# Altium schematic sheet demo_dermis_main_testboard_ncd2400.SchDoc
size E
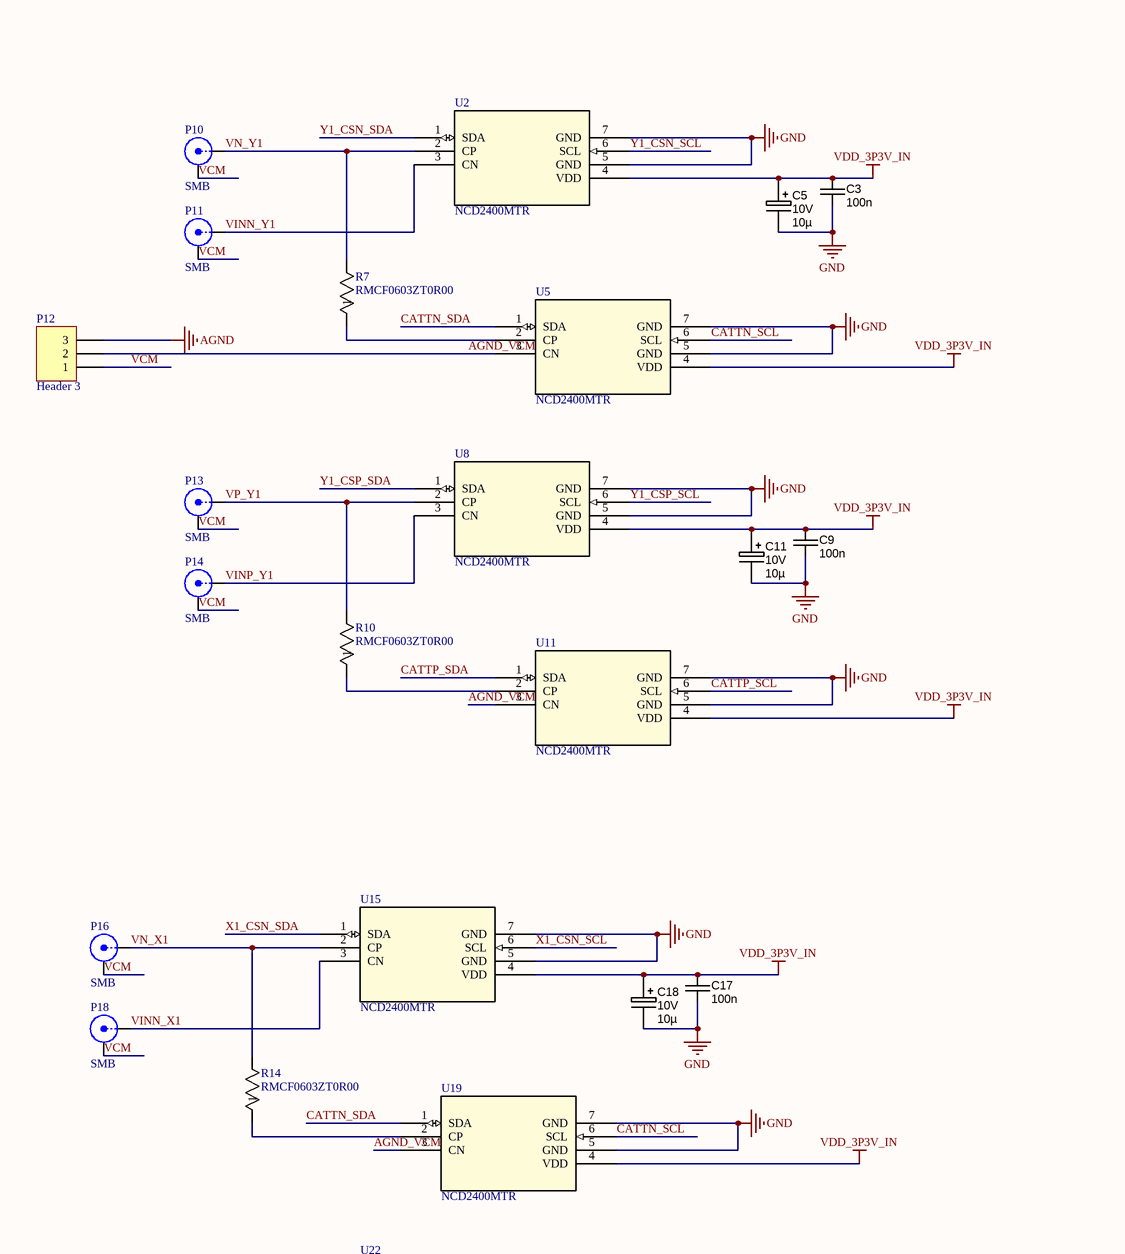
[diagram p0: demo_dermis_main_testboard_ncd2400.SchDoc, top left]
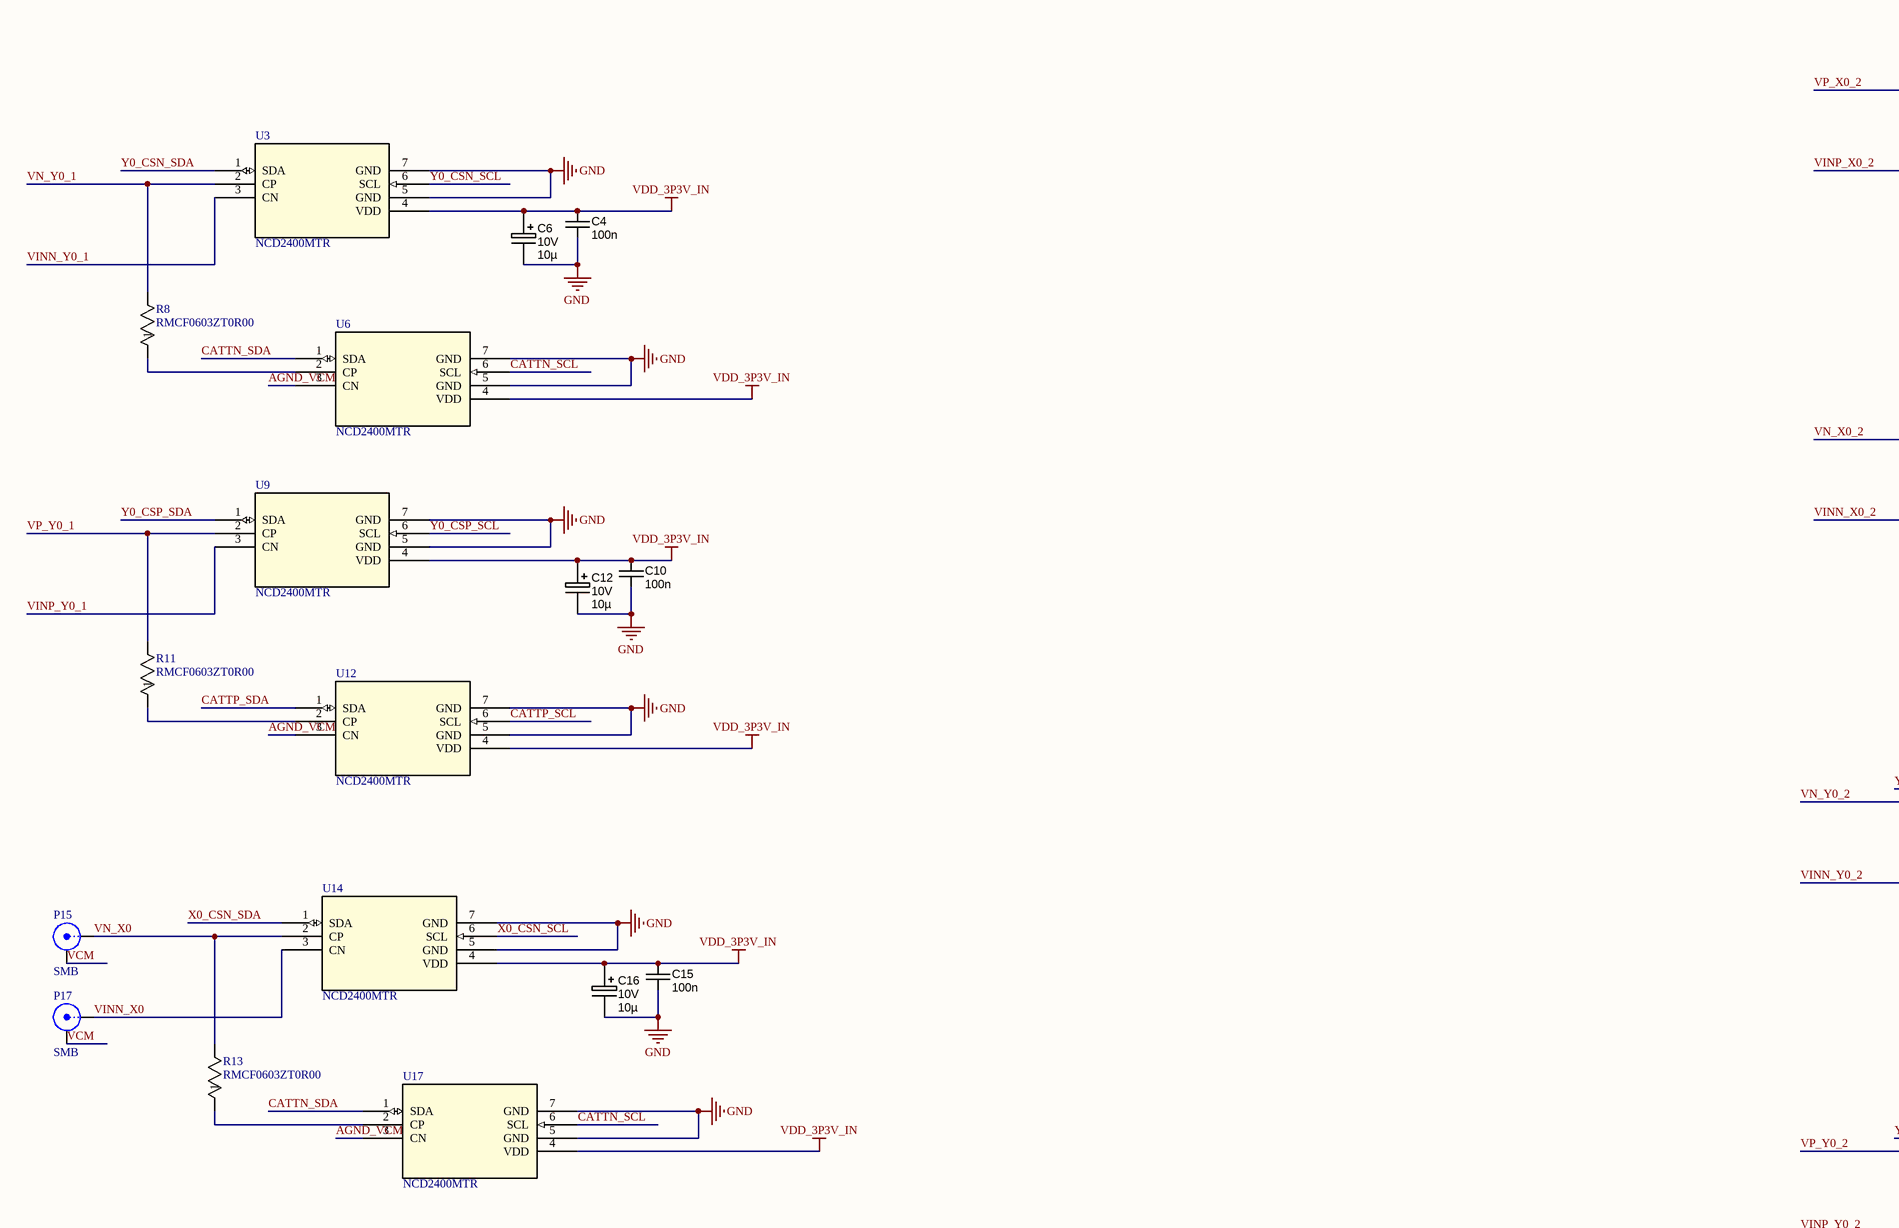
[diagram p1: demo_dermis_main_testboard_ncd2400.SchDoc, top middle]
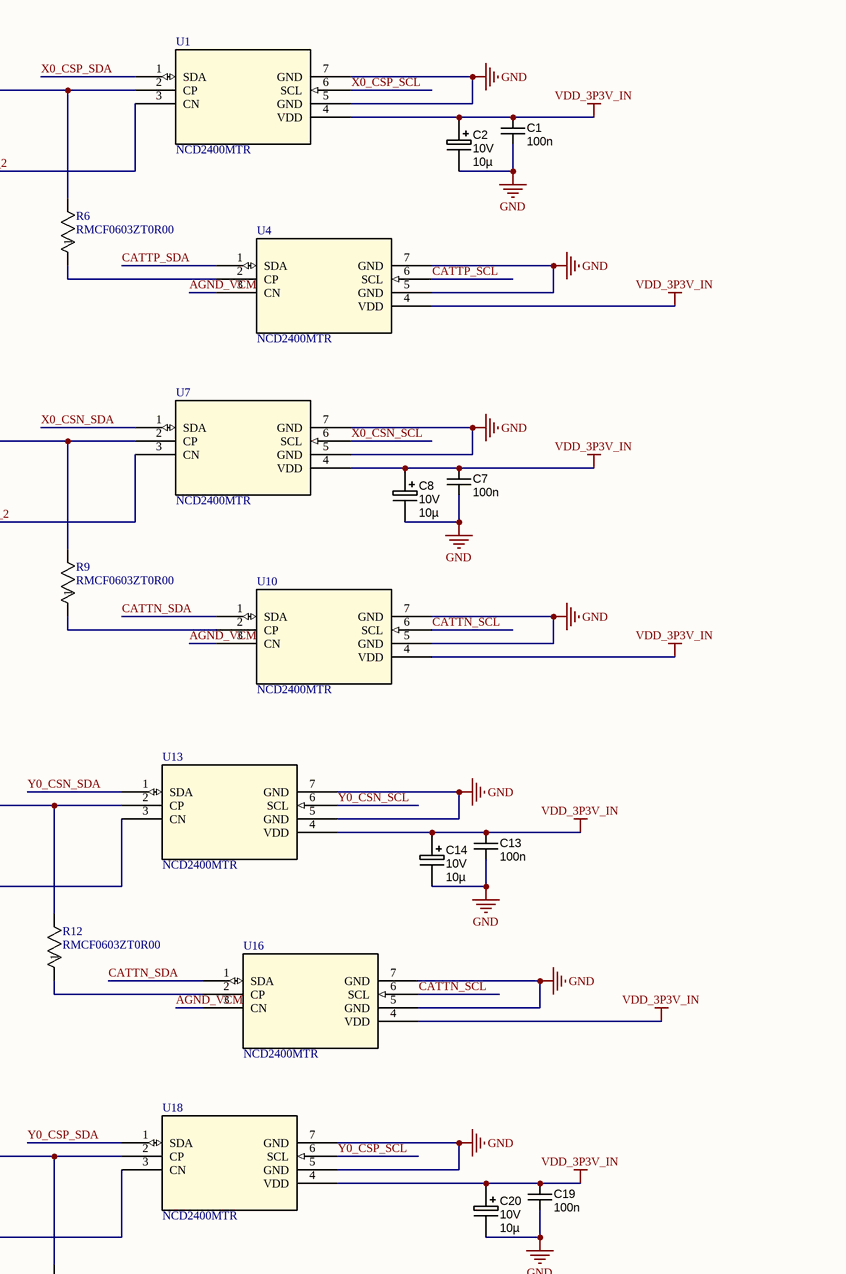
[diagram p2: demo_dermis_main_testboard_ncd2400.SchDoc, top right]
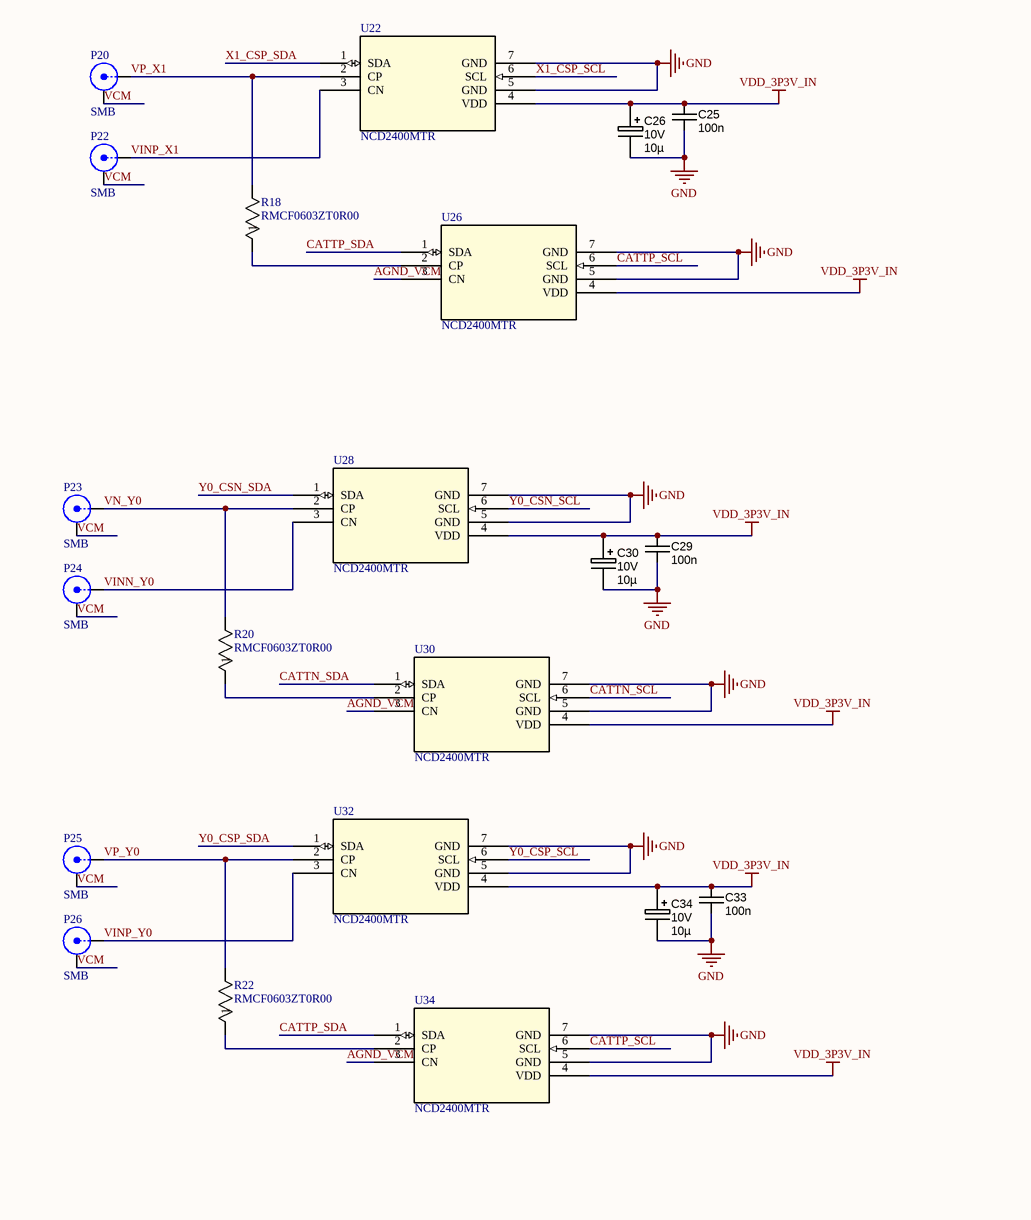
[diagram p3: demo_dermis_main_testboard_ncd2400.SchDoc, bottom left]
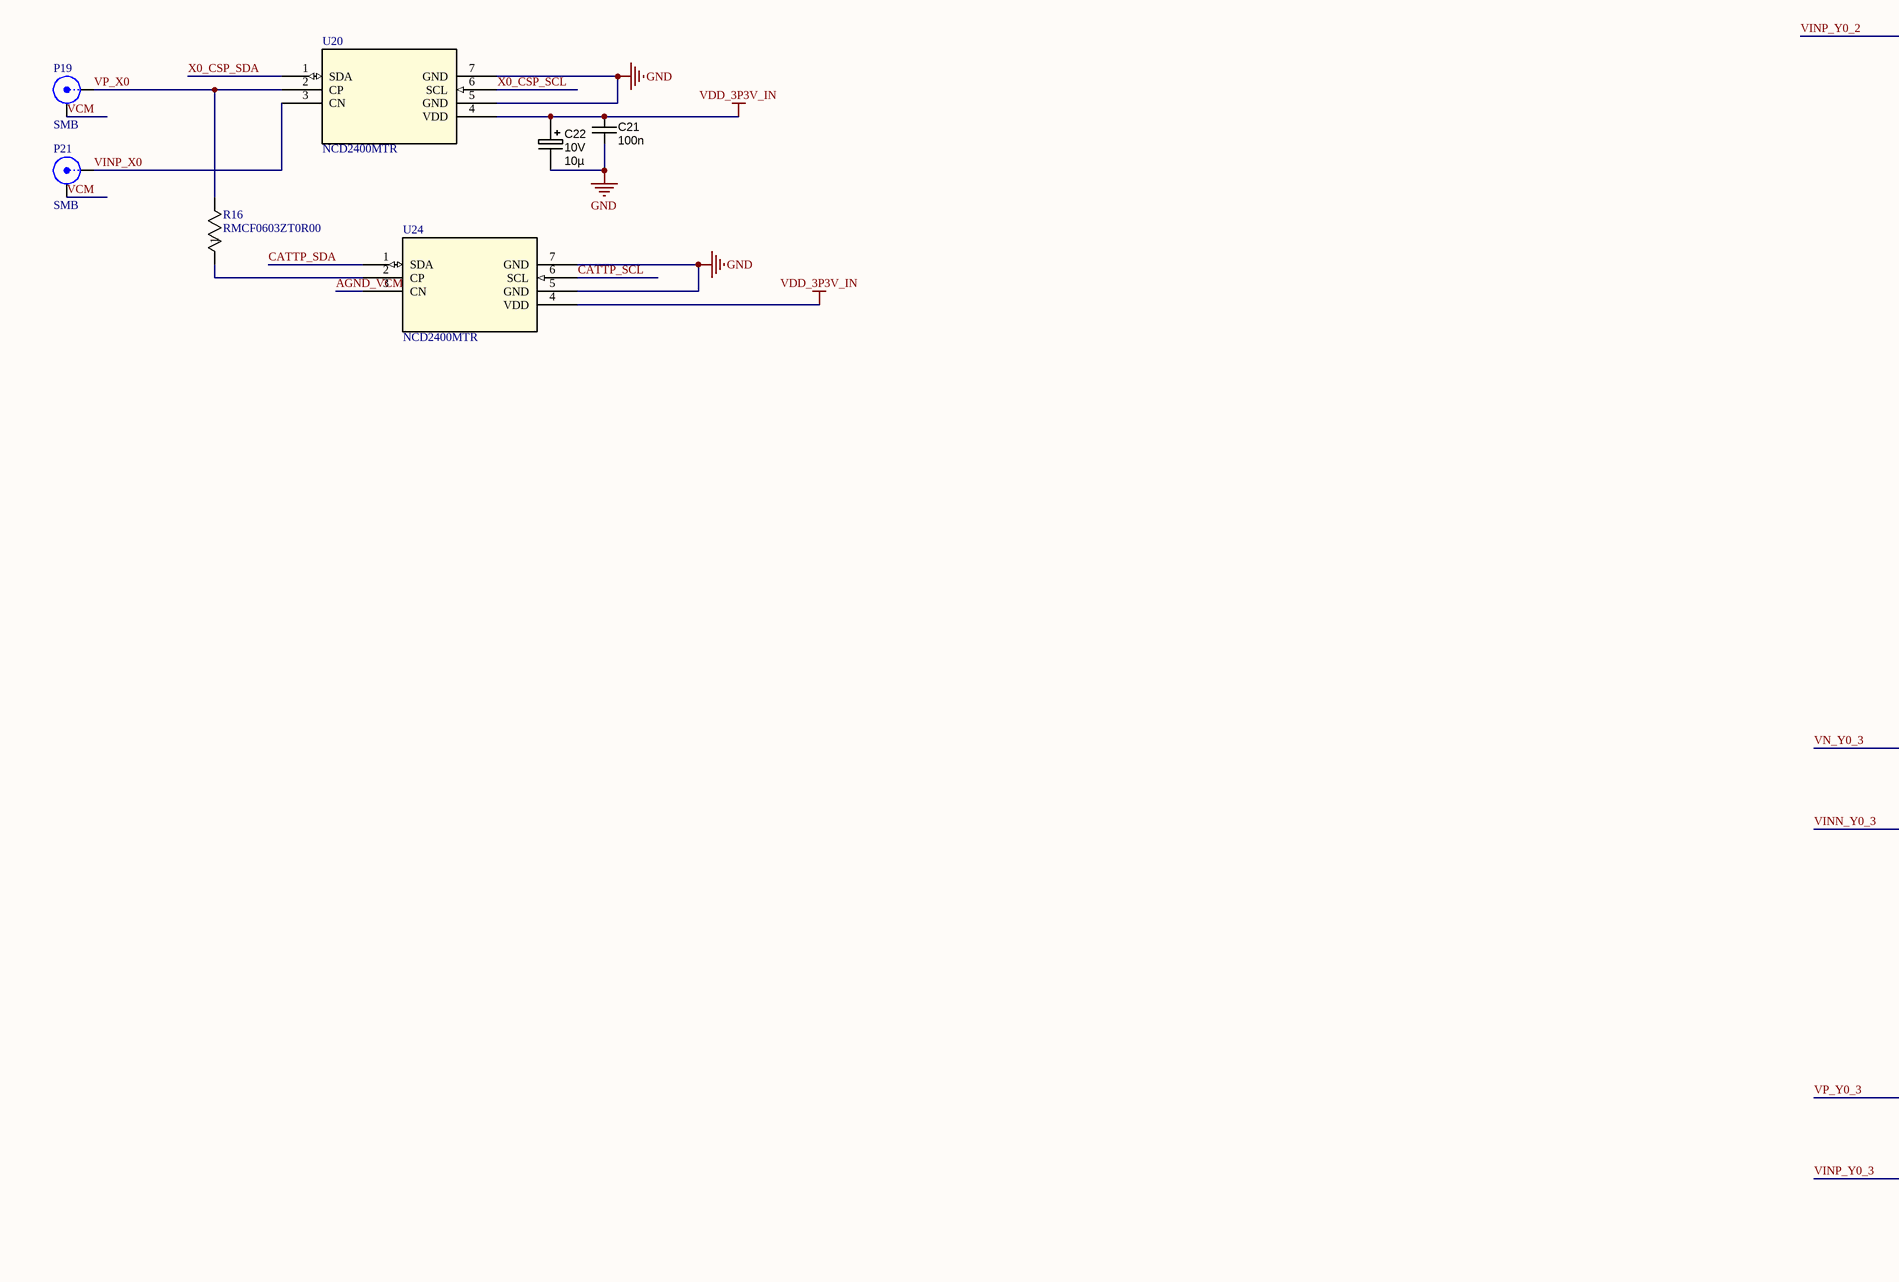
[diagram p4: demo_dermis_main_testboard_ncd2400.SchDoc, bottom middle]
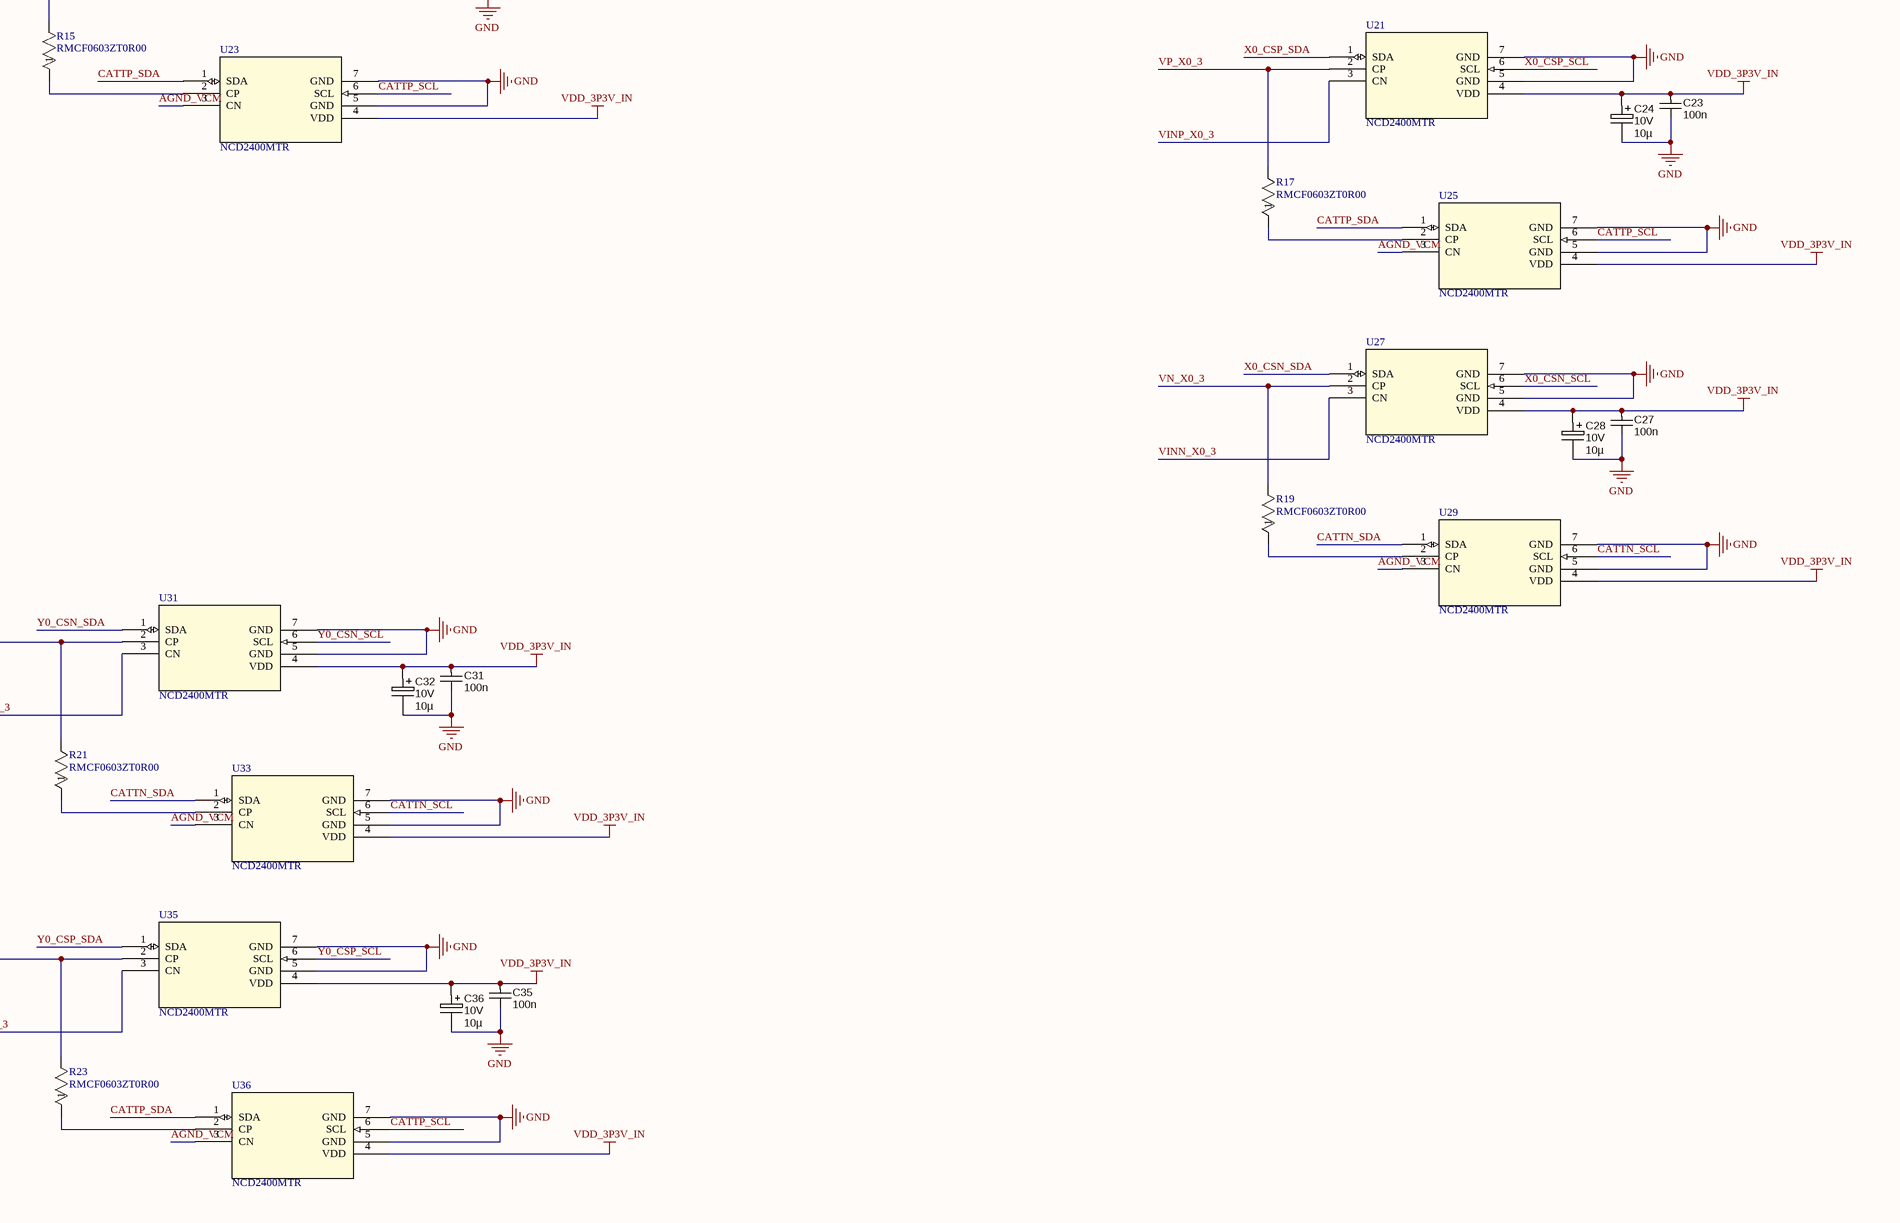
[diagram p5: demo_dermis_main_testboard_ncd2400.SchDoc, bottom right]

## Parts
C1  value 100n  [CAPC1608N]  (hidden comment: approved sub OK)
C2  Ratings: 10V  [CAPMP2012X150USR]  (hidden comment: 10µ)
C3  value 100n  [CAPC1608N]  (hidden comment: approved sub OK)
C4  value 100n  [CAPC1608N]  (hidden comment: approved sub OK)
C5  Ratings: 10V  [CAPMP2012X150USR]  (hidden comment: 10µ)
C6  Ratings: 10V  [CAPMP2012X150USR]  (hidden comment: 10µ)
C7  value 100n  [CAPC1608N]  (hidden comment: approved sub OK)
C8  Ratings: 10V  [CAPMP2012X150USR]  (hidden comment: 10µ)
C9  value 100n  [CAPC1608N]  (hidden comment: approved sub OK)
C10  value 100n  [CAPC1608N]  (hidden comment: approved sub OK)
C11  Ratings: 10V  [CAPMP2012X150USR]  (hidden comment: 10µ)
C12  Ratings: 10V  [CAPMP2012X150USR]  (hidden comment: 10µ)
C13  value 100n  [CAPC1608N]  (hidden comment: approved sub OK)
C14  Ratings: 10V  [CAPMP2012X150USR]  (hidden comment: 10µ)
C15  value 100n  [CAPC1608N]  (hidden comment: approved sub OK)
C16  Ratings: 10V  [CAPMP2012X150USR]  (hidden comment: 10µ)
C17  value 100n  [CAPC1608N]  (hidden comment: approved sub OK)
C18  Ratings: 10V  [CAPMP2012X150USR]  (hidden comment: 10µ)
C19  value 100n  [CAPC1608N]  (hidden comment: approved sub OK)
C20  Ratings: 10V  [CAPMP2012X150USR]  (hidden comment: 10µ)
C21  value 100n  [CAPC1608N]  (hidden comment: approved sub OK)
C22  Ratings: 10V  [CAPMP2012X150USR]  (hidden comment: 10µ)
C23  value 100n  [CAPC1608N]  (hidden comment: approved sub OK)
C24  Ratings: 10V  [CAPMP2012X150USR]  (hidden comment: 10µ)
C25  value 100n  [CAPC1608N]  (hidden comment: approved sub OK)
C26  Ratings: 10V  [CAPMP2012X150USR]  (hidden comment: 10µ)
C27  value 100n  [CAPC1608N]  (hidden comment: approved sub OK)
C28  Ratings: 10V  [CAPMP2012X150USR]  (hidden comment: 10µ)
C29  value 100n  [CAPC1608N]  (hidden comment: approved sub OK)
C30  Ratings: 10V  [CAPMP2012X150USR]  (hidden comment: 10µ)
C31  value 100n  [CAPC1608N]  (hidden comment: approved sub OK)
C32  Ratings: 10V  [CAPMP2012X150USR]  (hidden comment: 10µ)
C33  value 100n  [CAPC1608N]  (hidden comment: approved sub OK)
C34  Ratings: 10V  [CAPMP2012X150USR]  (hidden comment: 10µ)
C35  value 100n  [CAPC1608N]  (hidden comment: approved sub OK)
C36  Ratings: 10V  [CAPMP2012X150USR]  (hidden comment: 10µ)
P10  SMB  [SMB_V-RJ45]
P11  SMB  [SMB_V-RJ45]
P12  Header 3  [HDR1X3]
P13  SMB  [SMB_V-RJ45]
P14  SMB  [SMB_V-RJ45]
P15  SMB  [SMB_V-RJ45]
P16  SMB  [SMB_V-RJ45]
P17  SMB  [SMB_V-RJ45]
P18  SMB  [SMB_V-RJ45]
P19  SMB  [SMB_V-RJ45]
P20  SMB  [SMB_V-RJ45]
P21  SMB  [SMB_V-RJ45]
P22  SMB  [SMB_V-RJ45]
P23  SMB  [SMB_V-RJ45]
P24  SMB  [SMB_V-RJ45]
P25  SMB  [SMB_V-RJ45]
P26  SMB  [SMB_V-RJ45]
R6  RMCF0603ZT0R00  [STA_RMCF0603_STP]
R7  RMCF0603ZT0R00  [STA_RMCF0603_STP]
R8  RMCF0603ZT0R00  [STA_RMCF0603_STP]
R9  RMCF0603ZT0R00  [STA_RMCF0603_STP]
R10  RMCF0603ZT0R00  [STA_RMCF0603_STP]
R11  RMCF0603ZT0R00  [STA_RMCF0603_STP]
R12  RMCF0603ZT0R00  [STA_RMCF0603_STP]
R13  RMCF0603ZT0R00  [STA_RMCF0603_STP]
R14  RMCF0603ZT0R00  [STA_RMCF0603_STP]
R15  RMCF0603ZT0R00  [STA_RMCF0603_STP]
R16  RMCF0603ZT0R00  [STA_RMCF0603_STP]
R17  RMCF0603ZT0R00  [STA_RMCF0603_STP]
R18  RMCF0603ZT0R00  [STA_RMCF0603_STP]
R19  RMCF0603ZT0R00  [STA_RMCF0603_STP]
R20  RMCF0603ZT0R00  [STA_RMCF0603_STP]
R21  RMCF0603ZT0R00  [STA_RMCF0603_STP]
R22  RMCF0603ZT0R00  [STA_RMCF0603_STP]
R23  RMCF0603ZT0R00  [STA_RMCF0603_STP]
U1  NCD2400MTR  [DFN-6_IXY]
U2  NCD2400MTR  [DFN-6_IXY]
U3  NCD2400MTR  [DFN-6_IXY]
U4  NCD2400MTR  [DFN-6_IXY]
U5  NCD2400MTR  [DFN-6_IXY]
U6  NCD2400MTR  [DFN-6_IXY]
U7  NCD2400MTR  [DFN-6_IXY]
U8  NCD2400MTR  [DFN-6_IXY]
U9  NCD2400MTR  [DFN-6_IXY]
U10  NCD2400MTR  [DFN-6_IXY]
U11  NCD2400MTR  [DFN-6_IXY]
U12  NCD2400MTR  [DFN-6_IXY]
U13  NCD2400MTR  [DFN-6_IXY]
U14  NCD2400MTR  [DFN-6_IXY]
U15  NCD2400MTR  [DFN-6_IXY]
U16  NCD2400MTR  [DFN-6_IXY]
U17  NCD2400MTR  [DFN-6_IXY]
U18  NCD2400MTR  [DFN-6_IXY]
U19  NCD2400MTR  [DFN-6_IXY]
U20  NCD2400MTR  [DFN-6_IXY]
U21  NCD2400MTR  [DFN-6_IXY]
U22  NCD2400MTR  [DFN-6_IXY]
U23  NCD2400MTR  [DFN-6_IXY]
U24  NCD2400MTR  [DFN-6_IXY]
U25  NCD2400MTR  [DFN-6_IXY]
U26  NCD2400MTR  [DFN-6_IXY]
U27  NCD2400MTR  [DFN-6_IXY]
U28  NCD2400MTR  [DFN-6_IXY]
U29  NCD2400MTR  [DFN-6_IXY]
U30  NCD2400MTR  [DFN-6_IXY]
U31  NCD2400MTR  [DFN-6_IXY]
U32  NCD2400MTR  [DFN-6_IXY]
U33  NCD2400MTR  [DFN-6_IXY]
U34  NCD2400MTR  [DFN-6_IXY]
U35  NCD2400MTR  [DFN-6_IXY]
U36  NCD2400MTR  [DFN-6_IXY]

## Nets
AGND: P12.3
GND: C1.2 C2.2 C3.2 C4.2 C5.2 C6.2 C7.2 C8.2 C9.2 C10.2 C11.2 C12.2 C13.2 C14.2 C15.2 C16.2 C17.2 C18.2 C19.2 C20.2 C21.2 C22.2 C23.2 C24.2 C25.2 C26.2 C27.2 C28.2 C29.2 C30.2 C31.2 C32.2 C33.2 C34.2 C35.2 C36.2 U1.5(GND) U1.7(GND) U2.5(GND) U2.7(GND) U3.5(GND) U3.7(GND) U4.5(GND) U4.7(GND) U5.5(GND) U5.7(GND) U6.5(GND) U6.7(GND) U7.5(GND) U7.7(GND) U8.5(GND) U8.7(GND) U9.5(GND) U9.7(GND) U10.5(GND) U10.7(GND) U11.5(GND) U11.7(GND) U12.5(GND) U12.7(GND) U13.5(GND) U13.7(GND) U14.5(GND) U14.7(GND) U15.5(GND) U15.7(GND) U16.5(GND) U16.7(GND) U17.5(GND) U17.7(GND) U18.5(GND) U18.7(GND) U19.5(GND) U19.7(GND) U20.5(GND) U20.7(GND) U21.5(GND) U21.7(GND) U22.5(GND) U22.7(GND) U23.5(GND) U23.7(GND) U24.5(GND) U24.7(GND) U25.5(GND) U25.7(GND) U26.5(GND) U26.7(GND) U27.5(GND) U27.7(GND) U28.5(GND) U28.7(GND) U29.5(GND) U29.7(GND) U30.5(GND) U30.7(GND) U31.5(GND) U31.7(GND) U32.5(GND) U32.7(GND) U33.5(GND) U33.7(GND) U34.5(GND) U34.7(GND) U35.5(GND) U35.7(GND) U36.5(GND) U36.7(GND)
VDD_3P3V_IN: C1.1 C2.1 C3.1 C4.1 C5.1 C6.1 C7.1 C8.1 C9.1 C10.1 C11.1 C12.1 C13.1 C14.1 C15.1 C16.1 C17.1 C18.1 C19.1 C20.1 C21.1 C22.1 C23.1 C24.1 C25.1 C26.1 C27.1 C28.1 C29.1 C30.1 C31.1 C32.1 C33.1 C34.1 C35.1 C36.1 U1.4(VDD) U2.4(VDD) U3.4(VDD) U4.4(VDD) U5.4(VDD) U6.4(VDD) U7.4(VDD) U8.4(VDD) U9.4(VDD) U10.4(VDD) U11.4(VDD) U12.4(VDD) U13.4(VDD) U14.4(VDD) U15.4(VDD) U16.4(VDD) U17.4(VDD) U18.4(VDD) U19.4(VDD) U20.4(VDD) U21.4(VDD) U22.4(VDD) U23.4(VDD) U24.4(VDD) U25.4(VDD) U26.4(VDD) U27.4(VDD) U28.4(VDD) U29.4(VDD) U30.4(VDD) U31.4(VDD) U32.4(VDD) U33.4(VDD) U34.4(VDD) U35.4(VDD) U36.4(VDD)
AGND_VCM: P12.2 U4.3(CN) U5.3(CN) U6.3(CN) U10.3(CN) U11.3(CN) U12.3(CN) U16.3(CN) U17.3(CN) U19.3(CN) U23.3(CN) U24.3(CN) U25.3(CN) U26.3(CN) U29.3(CN) U30.3(CN) U33.3(CN) U34.3(CN) U36.3(CN)
CATTN_SCL: U5.6(SCL) U6.6(SCL) U10.6(SCL) U16.6(SCL) U17.6(SCL) U19.6(SCL) U29.6(SCL) U30.6(SCL) U33.6(SCL)
CATTN_SDA: U5.1(SDA) U6.1(SDA) U10.1(SDA) U16.1(SDA) U17.1(SDA) U19.1(SDA) U29.1(SDA) U30.1(SDA) U33.1(SDA)
CATTP_SCL: U4.6(SCL) U11.6(SCL) U12.6(SCL) U23.6(SCL) U24.6(SCL) U25.6(SCL) U26.6(SCL) U34.6(SCL) U36.6(SCL)
CATTP_SDA: U4.1(SDA) U11.1(SDA) U12.1(SDA) U23.1(SDA) U24.1(SDA) U25.1(SDA) U26.1(SDA) U34.1(SDA) U36.1(SDA)
VCM: P10.2(Y) P11.2(Y) P12.1 P13.2(Y) P14.2(Y) P15.2(Y) P16.2(Y) P17.2(Y) P18.2(Y) P19.2(Y) P20.2(Y) P21.2(Y) P22.2(Y) P23.2(Y) P24.2(Y) P25.2(Y) P26.2(Y)
VINN_X0: P17.1(X) U14.3(CN)
VINN_X0_2: U7.3(CN)
VINN_X0_3: U27.3(CN)
VINN_X1: P18.1(X) U15.3(CN)
VINN_Y0: P24.1(X) U28.3(CN)
VINN_Y0_1: U3.3(CN)
VINN_Y0_2: U13.3(CN)
VINN_Y0_3: U31.3(CN)
VINN_Y1: P11.1(X) U2.3(CN)
VINP_X0: P21.1(X) U20.3(CN)
VINP_X0_2: U1.3(CN)
VINP_X0_3: U21.3(CN)
VINP_X1: P22.1(X) U22.3(CN)
VINP_Y0: P26.1(X) U32.3(CN)
VINP_Y0_1: U9.3(CN)
VINP_Y0_2: U18.3(CN)
VINP_Y0_3: U35.3(CN)
VINP_Y1: P14.1(X) U8.3(CN)
VN_X0: P15.1(X) R13.2 U14.2(CP)
VN_X0_2: R9.2 U7.2(CP)
VN_X0_3: R19.2 U27.2(CP)
VN_X1: P16.1(X) R14.2 U15.2(CP)
VN_Y0: P23.1(X) R20.2 U28.2(CP)
VN_Y0_1: R8.2 U3.2(CP)
VN_Y0_2: R12.2 U13.2(CP)
VN_Y0_3: R21.2 U31.2(CP)
VN_Y1: P10.1(X) R7.2 U2.2(CP)
VP_X0: P19.1(X) R16.2 U20.2(CP)
VP_X0_2: R6.2 U1.2(CP)
VP_X0_3: R17.2 U21.2(CP)
VP_X1: P20.1(X) R18.2 U22.2(CP)
VP_Y0: P25.1(X) R22.2 U32.2(CP)
VP_Y0_1: R11.2 U9.2(CP)
VP_Y0_2: R15.2 U18.2(CP)
VP_Y0_3: R23.2 U35.2(CP)
VP_Y1: P13.1(X) R10.2 U8.2(CP)
X0_CSN_SCL: U7.6(SCL) U14.6(SCL) U27.6(SCL)
X0_CSN_SDA: U7.1(SDA) U14.1(SDA) U27.1(SDA)
X0_CSP_SCL: U1.6(SCL) U20.6(SCL) U21.6(SCL)
X0_CSP_SDA: U1.1(SDA) U20.1(SDA) U21.1(SDA)
X1_CSN_SCL: U15.6(SCL)
X1_CSN_SDA: U15.1(SDA)
X1_CSP_SCL: U22.6(SCL)
X1_CSP_SDA: U22.1(SDA)
Y0_CSN_SCL: U3.6(SCL) U13.6(SCL) U28.6(SCL) U31.6(SCL)
Y0_CSN_SDA: U3.1(SDA) U13.1(SDA) U28.1(SDA) U31.1(SDA)
Y0_CSP_SCL: U9.6(SCL) U18.6(SCL) U32.6(SCL) U35.6(SCL)
Y0_CSP_SDA: U9.1(SDA) U18.1(SDA) U32.1(SDA) U35.1(SDA)
Y1_CSN_SCL: U2.6(SCL)
Y1_CSN_SDA: U2.1(SDA)
Y1_CSP_SCL: U8.6(SCL)
Y1_CSP_SDA: U8.1(SDA)
NetR6_1: R6.1 U4.2(CP)
NetR7_1: R7.1 U5.2(CP)
NetR8_1: R8.1 U6.2(CP)
NetR9_1: R9.1 U10.2(CP)
NetR10_1: R10.1 U11.2(CP)
NetR11_1: R11.1 U12.2(CP)
NetR12_1: R12.1 U16.2(CP)
NetR13_1: R13.1 U17.2(CP)
NetR14_1: R14.1 U19.2(CP)
NetR15_1: R15.1 U23.2(CP)
NetR16_1: R16.1 U24.2(CP)
NetR17_1: R17.1 U25.2(CP)
NetR18_1: R18.1 U26.2(CP)
NetR19_1: R19.1 U29.2(CP)
NetR20_1: R20.1 U30.2(CP)
NetR21_1: R21.1 U33.2(CP)
NetR22_1: R22.1 U34.2(CP)
NetR23_1: R23.1 U36.2(CP)

## Library data of the parts
C1 C3 C4 C7 C9 C10 C13 C15 C17 C19 C21 C23 C25 C27 C29 C31 C33 C35 = CAPC_100n_0603: Capacitor SMD Cer 100nF 10% 50V X7R 0603; Manufacturer 1: AVX Corporation; Manufacturer Part Number 1: 06035C104KAT2A; Ratings: 50V; X7R; Material: ceramic; Manufacturer 2: TDK Corporation; Manufacturer Part Number 2: C1608X7R1H104K; Package / Case: 0603 (1608 Metric); Tolerance: ±10%; Supplier 1: Digi-Key; Supplier Part Number 1: 478-5052-1-ND; ComponentLink1URL: http://www.avx.com/docs/Catalogs/cx7r.pdf; ComponentLink1Description: http://www.avx.com/docs/Catalogs/cx7r.pdf; Supplier 2: Digi-Key; Supplier Part Number 2: 445-1314-1-ND; ComponentLink2URL: http://product.tdk.com/capacitor/mlcc/en/documents/mlcc_commercial_general_en.pdf; ComponentLink2Description: http://product.tdk.com/capacitor/mlcc/en/documents/mlcc_commercial_general_en.pdf
C2 C5 C6 C8 C11 C12 C14 C16 C18 C20 C22 C24 C26 C28 C30 C32 C34 C36 = CAPT_10u_0805_10V: Capacitor SMD Tantalum 10uF 20% 10V 0805; Manufacturer 1: AVX Corporation; Manufacturer Part Number 1: TAJP106M010RNJ; Package / Case: 0805 (2012 metric); Tolerance: ±20%; Material: Tantalum; Supplier 1: Digi-Key; Supplier Part Number 1: 478-3281-1-ND; Value: 10µ
P10 P11 P13-P26 = SMB: SMB Straight Connector; LatestRevisionDate: 17-Jul-2002; LatestRevisionNote: Re-released for DXP Platform.; Publisher: Altium Limited
P12 = Header 3: Header, 3-Pin; LatestRevisionDate: 17-Jul-2002; LatestRevisionNote: Re-released for DXP Platform.; Publisher: Altium Limited
R6-R23 = RMCF0603ZT0R00: No Description Available; Mfr_Name: Stackpole International
U1-U36 = NCD2400MTR: No Description Available; Mfr_Name: Littelfuse / IXYS; RefDes: RefDes; Type: Type